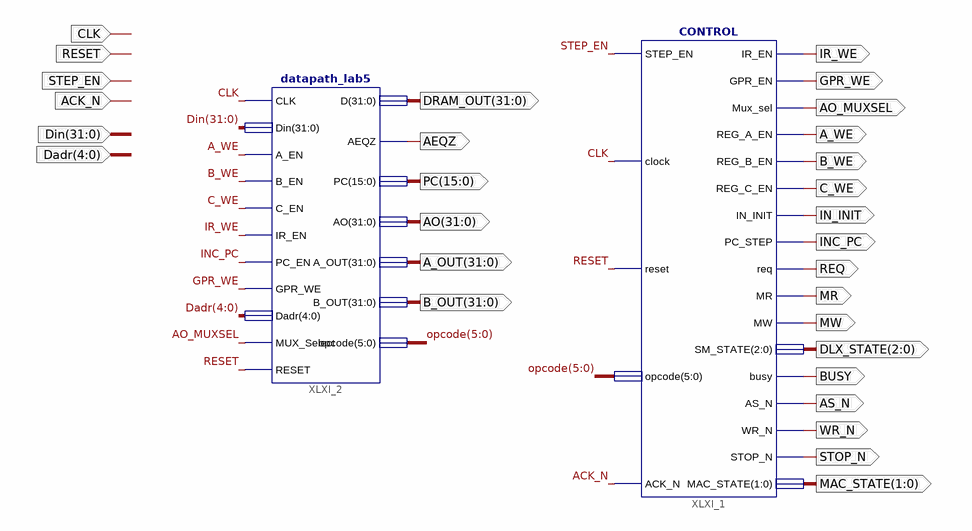
[diagram p0: schematic sheet 1]
// Xilinx ISE schematic LSM.sch (spartan6) as structural Verilog: 2 symbols, 29 ports
module LSM (
  input  CLK,
  input  RESET,
  input  STEP_EN,
  input  ACK_N,
  input  [31:0] Din,
  input  [4:0] Dadr,
  output A_WE,
  output IR_WE,
  output GPR_WE,
  output AO_MUXSEL,
  output B_WE,
  output C_WE,
  output INC_PC,
  output [31:0] DRAM_OUT,
  output AS_N,
  output IN_INIT,
  output MR,
  output MW,
  output BUSY,
  output [1:0] MAC_STATE,
  output [2:0] DLX_STATE,
  output WR_N,
  output REQ,
  output STOP_N,
  output AEQZ,
  output [15:0] PC,
  output [31:0] AO,
  output [31:0] A_OUT,
  output [31:0] B_OUT
);

  wire [5:0] opcode;

  CONTROL XLXI_1 (
    .STEP_EN(STEP_EN), .clock(CLK), .reset(RESET), .opcode(opcode), .ACK_N(ACK_N), .IR_EN(IR_WE),
    .GPR_EN(GPR_WE), .Mux_sel(AO_MUXSEL), .REG_A_EN(A_WE), .REG_B_EN(B_WE), .REG_C_EN(C_WE),
    .IN_INIT(IN_INIT), .PC_STEP(INC_PC), .req(REQ), .MR(MR), .MW(MW), .SM_STATE(DLX_STATE), .busy(BUSY),
    .AS_N(AS_N), .WR_N(WR_N), .STOP_N(STOP_N), .MAC_STATE(MAC_STATE));
  datapath_lab5 XLXI_2 (
    .CLK(CLK), .Din(Din), .A_EN(A_WE), .B_EN(B_WE), .C_EN(C_WE), .IR_EN(IR_WE), .PC_EN(INC_PC),
    .GPR_WE(GPR_WE), .Dadr(Dadr), .MUX_Select(AO_MUXSEL), .RESET(RESET), .D(DRAM_OUT), .AEQZ(AEQZ), .PC(PC),
    .AO(AO), .A_OUT(A_OUT), .B_OUT(B_OUT), .opcode(opcode));
endmodule
